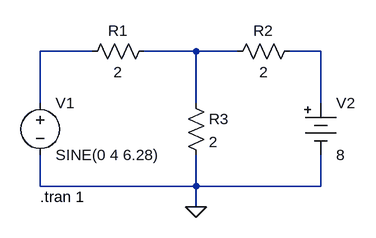
[diagram p0: schematic g3_p2.asc]
g3_p2.asc, the LTspice schematic file:
Version 4
SHEET 1 880 680
WIRE 32 96 -48 96
WIRE 192 96 112 96
WIRE 256 96 192 96
WIRE 384 96 336 96
WIRE -48 176 -48 96
WIRE 192 176 192 96
WIRE 384 176 384 96
WIRE -48 304 -48 256
WIRE 192 304 192 256
WIRE 192 304 -48 304
WIRE 384 304 384 256
WIRE 384 304 192 304
WIRE 192 336 192 304
FLAG 192 336 0
SYMBOL res 16 112 R270
WINDOW 0 32 56 VTop 2
WINDOW 3 0 56 VBottom 2
SYMATTR InstName R1
SYMATTR Value 2
SYMBOL res 240 112 R270
WINDOW 0 32 56 VTop 2
WINDOW 3 0 56 VBottom 2
SYMATTR InstName R2
SYMATTR Value 2
SYMBOL res 176 160 R0
SYMATTR InstName R3
SYMATTR Value 2
SYMBOL Misc\\battery 384 160 R0
WINDOW 123 0 0 Left 0
WINDOW 39 0 0 Left 0
SYMATTR InstName V2
SYMATTR Value 8
SYMBOL voltage -48 160 R0
WINDOW 123 0 0 Left 0
WINDOW 39 0 0 Left 0
SYMATTR InstName V1
SYMATTR Value SINE(0 4 6.28)
TEXT -48 320 Left 2 !.tran 1

The netlist it stands for:
* g3_p2.asc
R1 N001 N002 2
R2 N002 N003 2
R3 N002 0 2
V2 N003 0 8
V1 N001 0 SINE(0 4 6.28)
.tran 1
.backanno
.end